# Altium schematic sheet SDMMC.SchDoc
size A; SheetNumber: 11; SheetTotal: 11
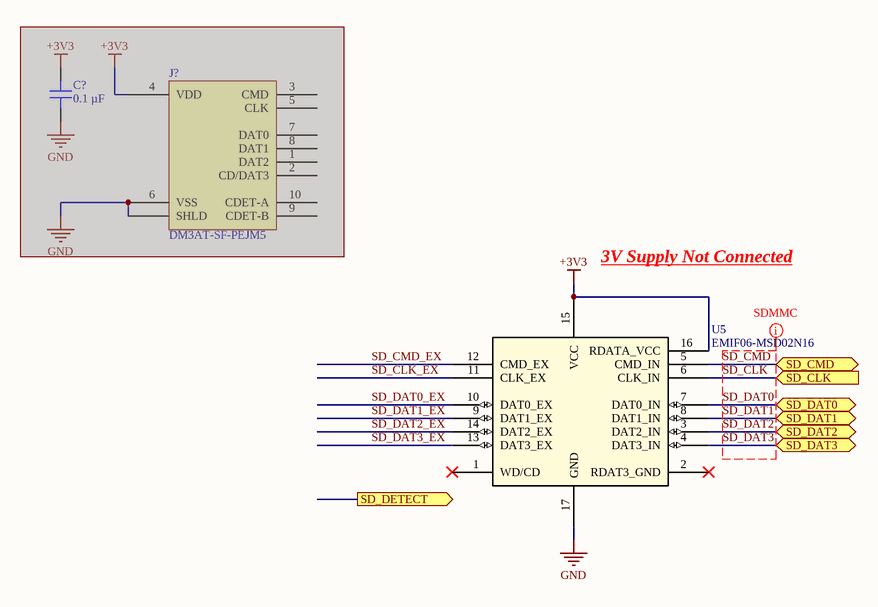
[diagram p0: SDMMC.SchDoc]

## Parts
C?  0.1 µF  [CAP 0402_1005]  (masked out: inside a compile mask, not in the netlist)
J?  DM3AT-SF-PEJM5  [HIROSE DM3AT-SF-PEJM5]  (masked out: inside a compile mask, not in the netlist)
U5  EMIF06-MSD02N16  [EMIF06MSD02N16]

## Ports
SD_CLK (in), SD_CMD (bidir), SD_DAT0 (bidir), SD_DAT1 (bidir), SD_DAT2 (bidir), SD_DAT3 (bidir), SD_DETECT (out)

## Nets
+3V3: U5.15(VCC) U5.16(RDATA_VCC)
GND: U5.17(GND)
SD_CLK: U5.6(CLK_IN) ; port SD_CLK
SD_CLK_EX: U5.11(CLK_EX)
SD_CMD: U5.5(CMD_IN) ; port SD_CMD
SD_CMD_EX: U5.12(CMD_EX)
SD_DAT0: U5.7(DAT0_IN) ; port SD_DAT0
SD_DAT0_EX: U5.10(DAT0_EX)
SD_DAT1: U5.8(DAT1_IN) ; port SD_DAT1
SD_DAT1_EX: U5.9(DAT1_EX)
SD_DAT2: U5.3(DAT2_IN) ; port SD_DAT2
SD_DAT2_EX: U5.14(DAT2_EX)
SD_DAT3: U5.4(DAT3_IN) ; port SD_DAT3
SD_DAT3_EX: U5.13(DAT3_EX)

Not connected (* = marked no-connect by the designer): U5 1(WD/CD)* 2(RDAT3_GND)*

## Layout directives
net class SDMMC: SD_CLK, SD_CMD, SD_DAT0, SD_DAT1, SD_DAT2, SD_DAT3

## Notes on the sheet
- 3V Supply Not Connected

## Library data of the parts
C? = C0402C104K4RECAUTO: CAP CER 0402 0.1UF 16V X7R 10%; manufacturer: KEMET; Part Number: C0402C104K4RECAUTO; Capacitance: 0.1 µF; Applications: Automotive, ESD Protection; componentlink1description: Datasheet; componentlink1url: https://api.kemet.com/component-edge/download/datasheet/C0402C104K4RECAUTO.pdf; componentlink2description: DigiKey Link; componentlink2url: https://www.digikey.com/en/products/detail/kemet/C0402C104K4RECAUTO/8563695; Device Package: 0402 (1005 Metric); lastupdated: 2/9/2024 8:04:38 PM; Lifecycle Status: Active; Minimum Order: 1; Mounting Type: Surface Mount, MLCC; Operating Temperature: -55°C ~ 125°C; Package / Case: 0402 (1005 Metric); packaging: TapeAndReel; partid: 1731; Part Status: Active; price: 0.01; Ratings: AEC-Q200; series: ESD SMD Auto X7R; Size / Dimension: 0.039" L x 0.020" W (1.00mm x 0.50mm); Supplier 1: DigiKey; Supplier Part Number 1: 399-17167-1-ND; Temperature Coefficient: X7R; Thickness (Max): 0.022" (0.55mm); Tolerance: ±10%; value: 0.1 µF; Voltage - Rated: 16V
J? = DM3AT-SF-PEJM5: CONN MICRO SD CARD PUSH-PUSH R/A; Manufacturer: Hirose Electric Co Ltd; Card Type: Secure Digital - microSD™; Connector Type: Connector and Ejector; Insertion, Removal Method: Push In, Push Out; Number of Positions: 10 (8 + 2); Part Number: DM3AT-SF-PEJM5; ComponentLink1Description: Datasheet; ComponentLink1URL: https://www.hirose.com/product/document?clcode=CL0609-0033-6-00&productname=DM3AT-SF-PEJ2M5&series=DM3&documenttype=Catalog&lang=en&documentid=D49662_en; ComponentLink2Description: DigiKey Link; ComponentLink2URL: //digikey.com/product-detail/en/hirose-electric-co-ltd/DM3AT-SF-PEJM5/HR1964TR-ND/2533565; Contact Finish: Gold; Features: Switch; Height Above Board: 0.066" (1.68mm); LastUpdated: 12/16/2019 8:34:40 PM; Lifecycle Status: 0; Minimum Order: 1; Mounting Feature: Normal, Standard - Top; Mounting Type: Surface Mount, Right Angle; Packaging: TapeAndReel; Part Status: Active; Price: 1.41; Series: DM3; Supplier 1: DigiKey; Supplier Part Number 1: HR1964TR-ND
U5 = EMIF06-MSD02N16: No Description Available; Mfr_Name: STMicroelectronics; RefDes: RefDes; Type: Type